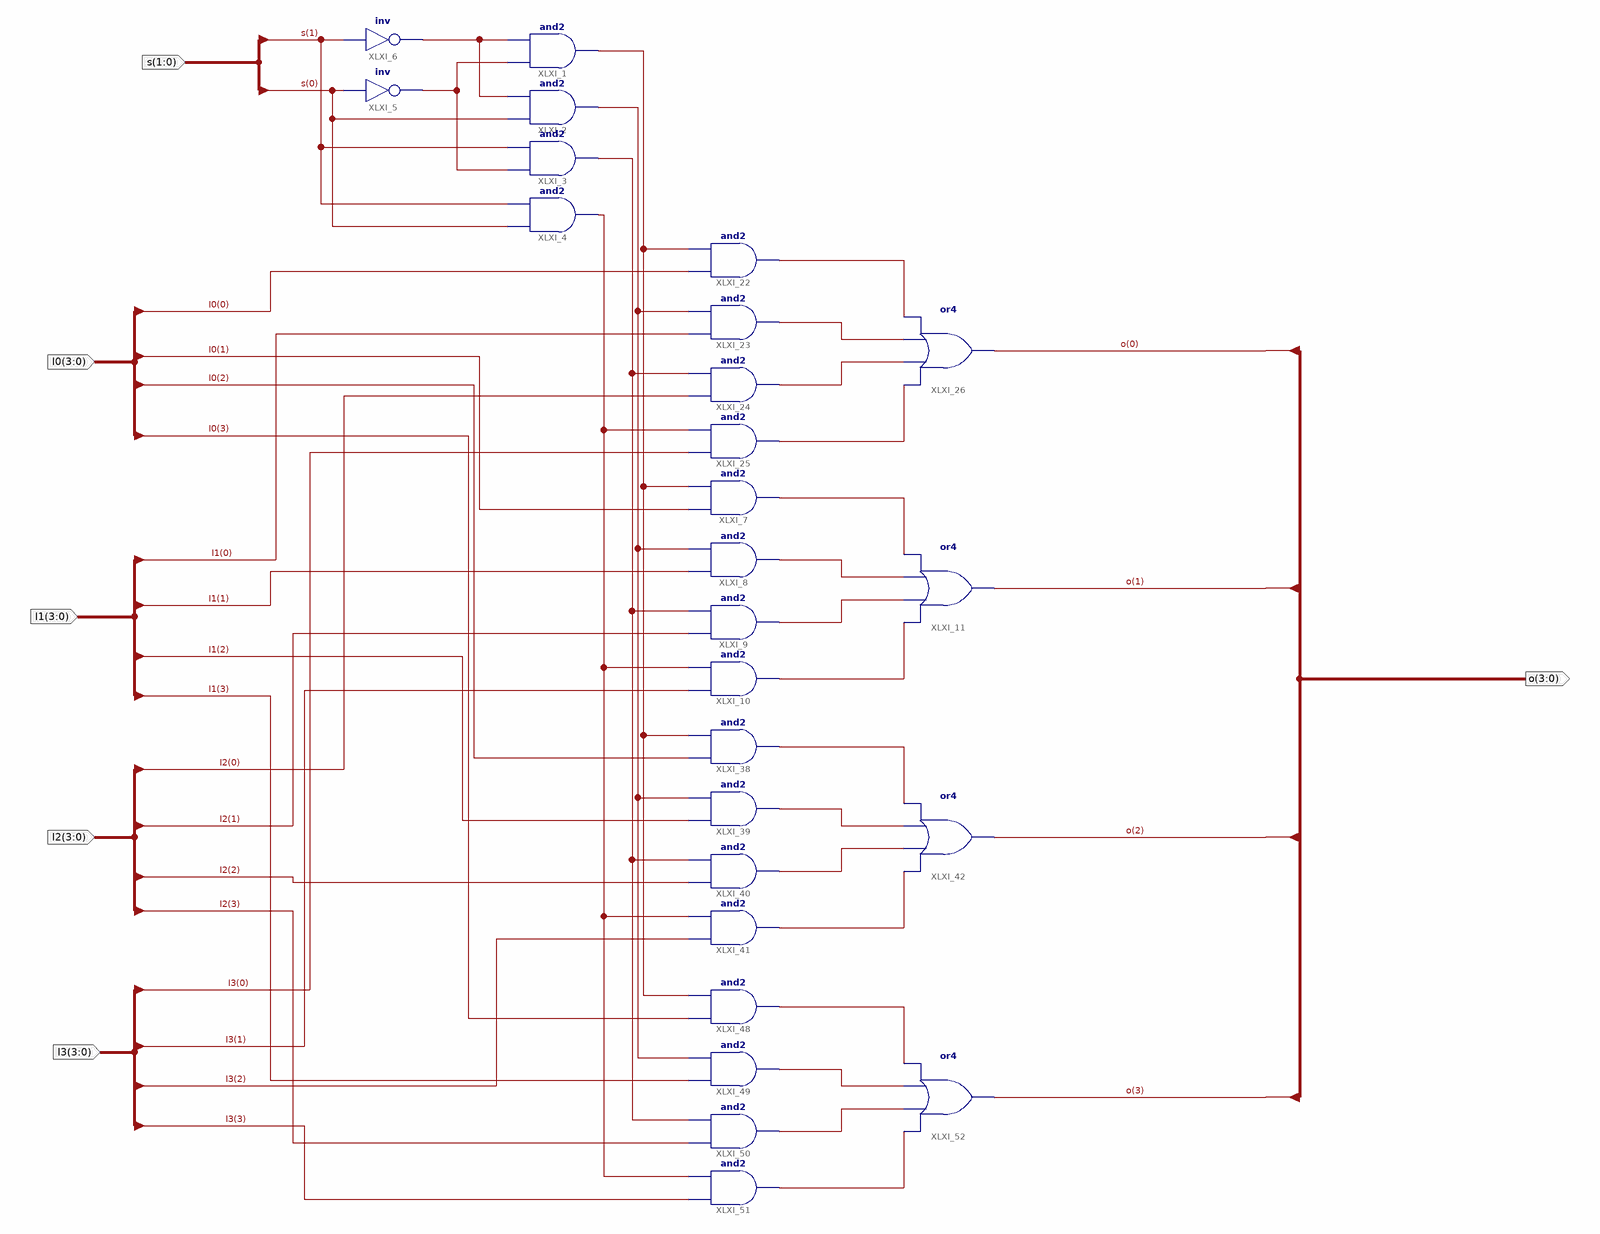
[diagram p0: schematic sheet 1]
// Xilinx ISE schematic MUX4T1_4.sch (kintex7) as structural Verilog: 26 symbols, 6 ports
module MUX4T1_4 (
  input  [1:0] s,
  input  [3:0] I0,
  input  [3:0] I1,
  input  [3:0] I2,
  input  [3:0] I3,
  output [3:0] o
);

  wire XLXN_2, XLXN_3, XLXN_4, XLXN_5, XLXN_6, XLXN_14, XLXN_16, XLXN_21, XLXN_22, XLXN_23, XLXN_24, XLXN_27,
       XLXN_28, XLXN_29, XLXN_53, XLXN_54, XLXN_55, XLXN_56, XLXN_63, XLXN_64, XLXN_65, XLXN_66;

  and XLXI_1 (XLXN_4, XLXN_3, XLXN_2);
  and XLXI_2 (XLXN_14, s[0], XLXN_2);
  and XLXI_3 (XLXN_5, XLXN_3, s[1]);
  and XLXI_4 (XLXN_16, s[0], s[1]);
  not XLXI_5 (XLXN_3, s[0]);
  not XLXI_6 (XLXN_2, s[1]);
  and XLXI_7 (XLXN_6, I0[1], XLXN_4);
  and XLXI_8 (XLXN_27, I1[1], XLXN_14);
  and XLXI_9 (XLXN_28, I2[1], XLXN_5);
  and XLXI_10 (XLXN_29, I3[1], XLXN_16);
  or XLXI_11 (o[1], XLXN_29, XLXN_28, XLXN_27, XLXN_6);
  and XLXI_38 (XLXN_53, I0[2], XLXN_4);
  and XLXI_39 (XLXN_54, I1[2], XLXN_14);
  and XLXI_40 (XLXN_55, I2[2], XLXN_5);
  and XLXI_41 (XLXN_56, I3[2], XLXN_16);
  or XLXI_42 (o[2], XLXN_56, XLXN_55, XLXN_54, XLXN_53);
  and XLXI_49 (XLXN_64, I1[3], XLXN_14);
  and XLXI_50 (XLXN_65, I2[3], XLXN_5);
  and XLXI_51 (XLXN_66, I3[3], XLXN_16);
  or XLXI_52 (o[3], XLXN_66, XLXN_65, XLXN_64, XLXN_63);
  and XLXI_48 (XLXN_63, I0[3], XLXN_4);
  and XLXI_22 (XLXN_21, I0[0], XLXN_4);
  and XLXI_23 (XLXN_22, I1[0], XLXN_14);
  and XLXI_24 (XLXN_23, I2[0], XLXN_5);
  and XLXI_25 (XLXN_24, I3[0], XLXN_16);
  or XLXI_26 (o[0], XLXN_24, XLXN_23, XLXN_22, XLXN_21);
endmodule
